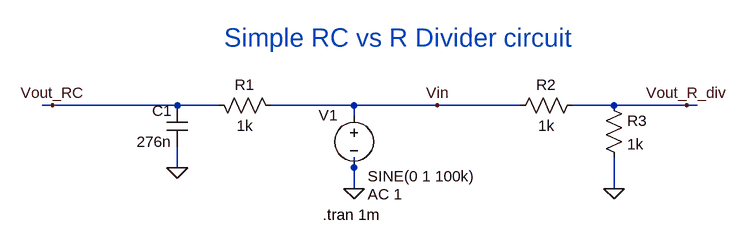
[diagram p0: schematic Simple RC vs R Divider circuit.asc]
Simple RC vs R Divider circuit.asc, the LTspice schematic file:
Version 4
SHEET 1 880 680
WIRE -480 240 -496 240
WIRE -288 240 -480 240
WIRE -224 240 -288 240
WIRE -16 240 -144 240
WIRE 112 240 -16 240
WIRE 240 240 112 240
WIRE 384 240 320 240
WIRE 496 240 384 240
WIRE 512 240 496 240
WIRE -16 256 -16 240
WIRE -288 336 -288 304
WIRE -16 336 -16 320
WIRE -16 368 -16 336
WIRE 384 368 384 320
FLAG -16 368 0
FLAG 384 368 0
FLAG -288 336 0
FLAG -480 240 Vout_RC
FLAG 112 240 Vin
FLAG 496 240 Vout_R_div
SYMBOL voltage -16 240 R0
WINDOW 0 -54 15 Left 2
WINDOW 3 21 109 Left 2
WINDOW 123 21 137 Left 2
WINDOW 39 0 0 Left 0
SYMATTR InstName V1
SYMATTR Value SINE(0 1 100k)
SYMATTR Value2 AC 1
SYMBOL res -240 224 M90
WINDOW 0 0 56 VBottom 2
WINDOW 3 32 56 VTop 2
SYMATTR InstName R1
SYMATTR Value 1k
SYMBOL res 336 224 R90
WINDOW 0 0 56 VBottom 2
WINDOW 3 32 56 VTop 2
SYMATTR InstName R2
SYMATTR Value 1k
SYMBOL res 368 224 R0
SYMATTR InstName R3
SYMATTR Value 1k
SYMBOL cap -272 240 M0
SYMATTR InstName C1
SYMATTR Value 276n
TEXT -64 408 Left 2 !.tran 1m
TEXT -216 136 Left 4 ;Simple RC vs R Divider circuit

The netlist it stands for:
* Simple RC vs R Divider circuit.asc
V1 Vin 0 SINE(0 1 100k) AC 1
R1 Vout_RC Vin 1k
R2 Vout_R_div Vin 1k
R3 Vout_R_div 0 1k
C1 Vout_RC 0 276n
.tran 1m
* Simple RC vs R Divider circuit
.backanno
.end